# EAGLE schematic robo_sugador (EAGLE 9.1.1)
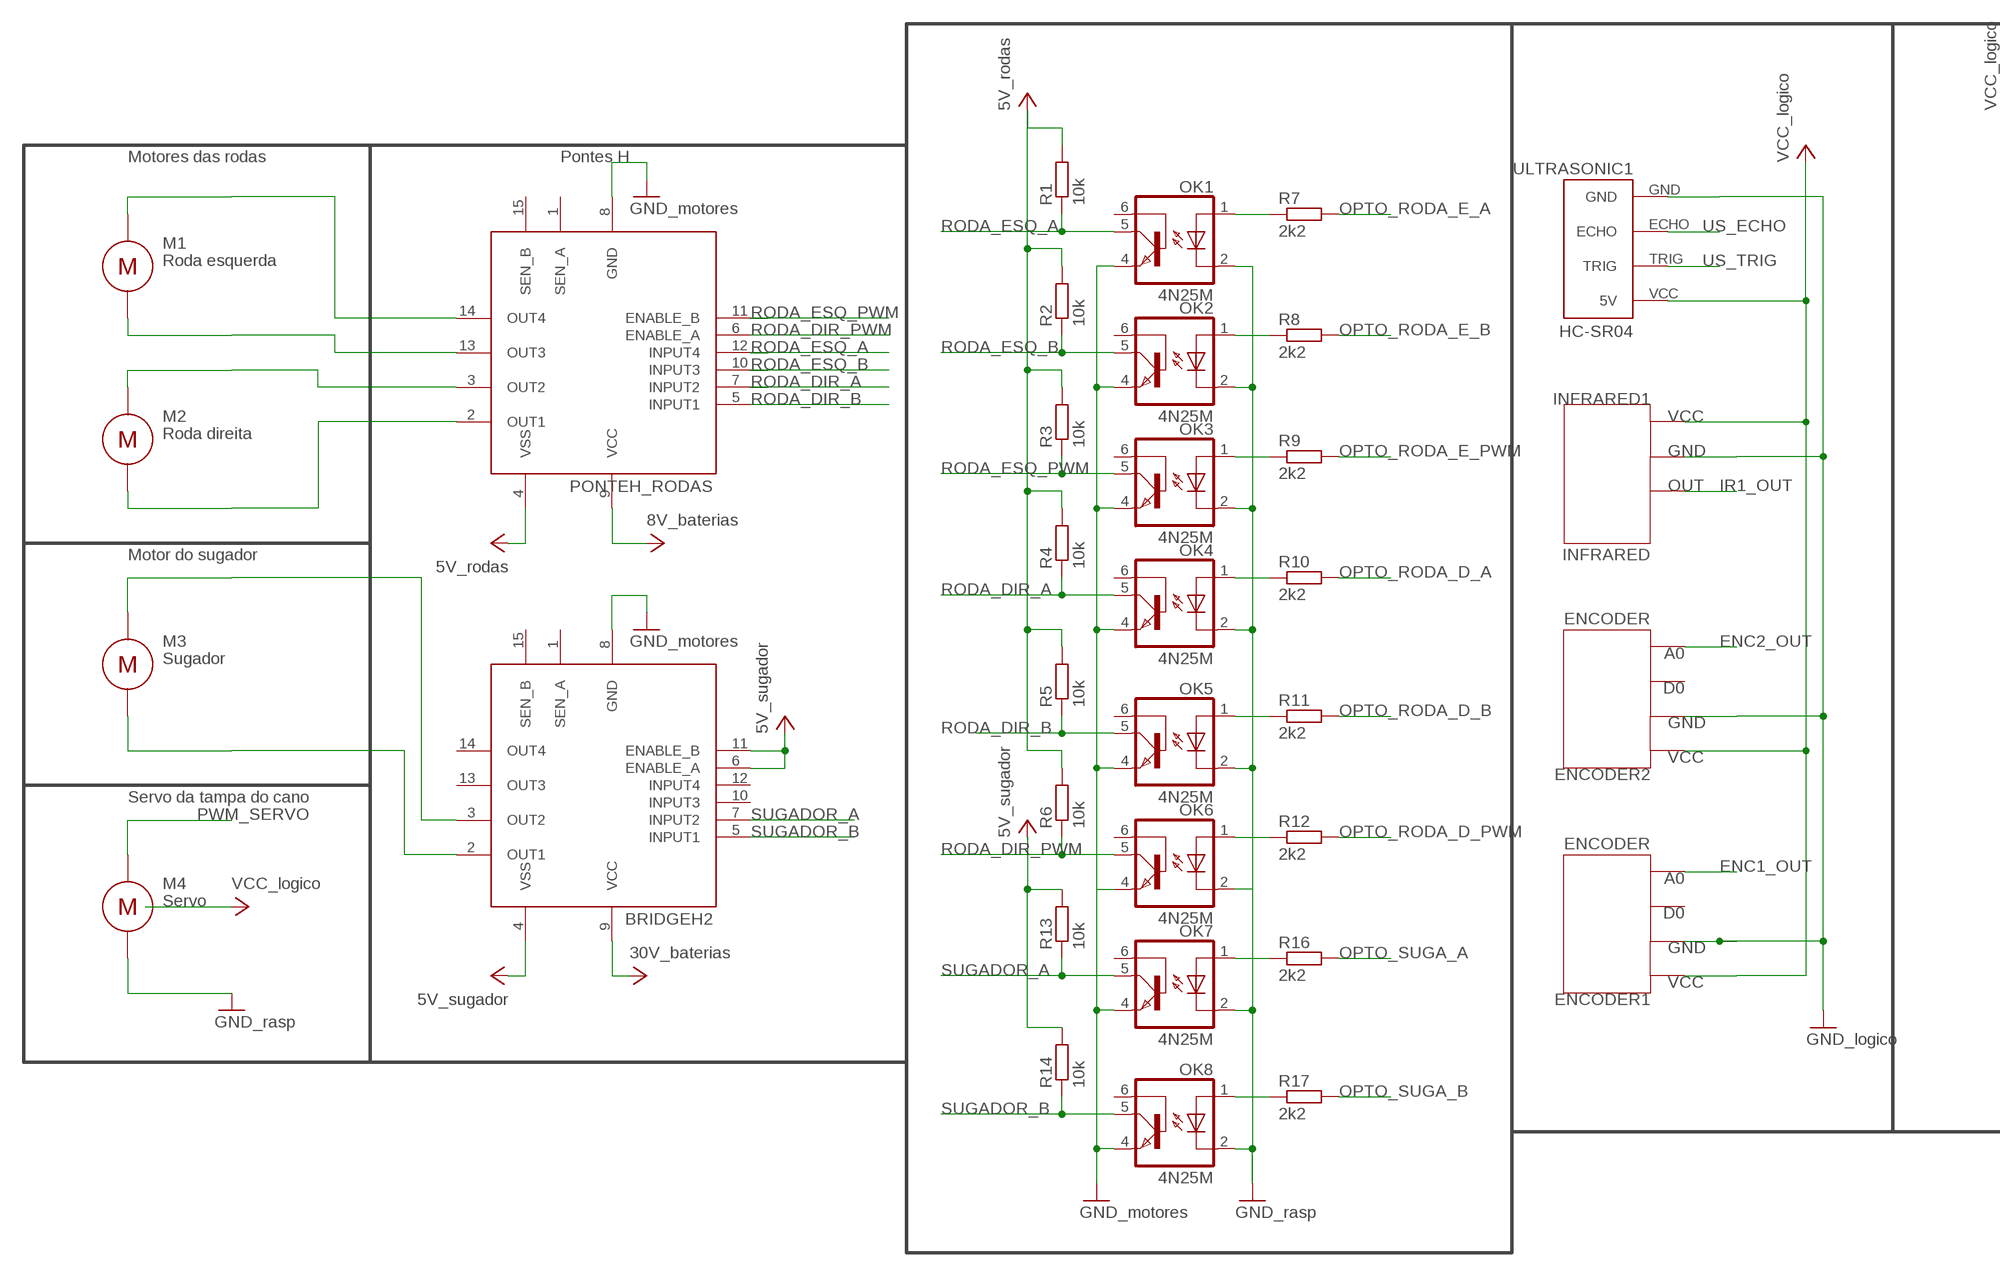
[diagram p0: schematic, sheet 1, part 1 of 2]
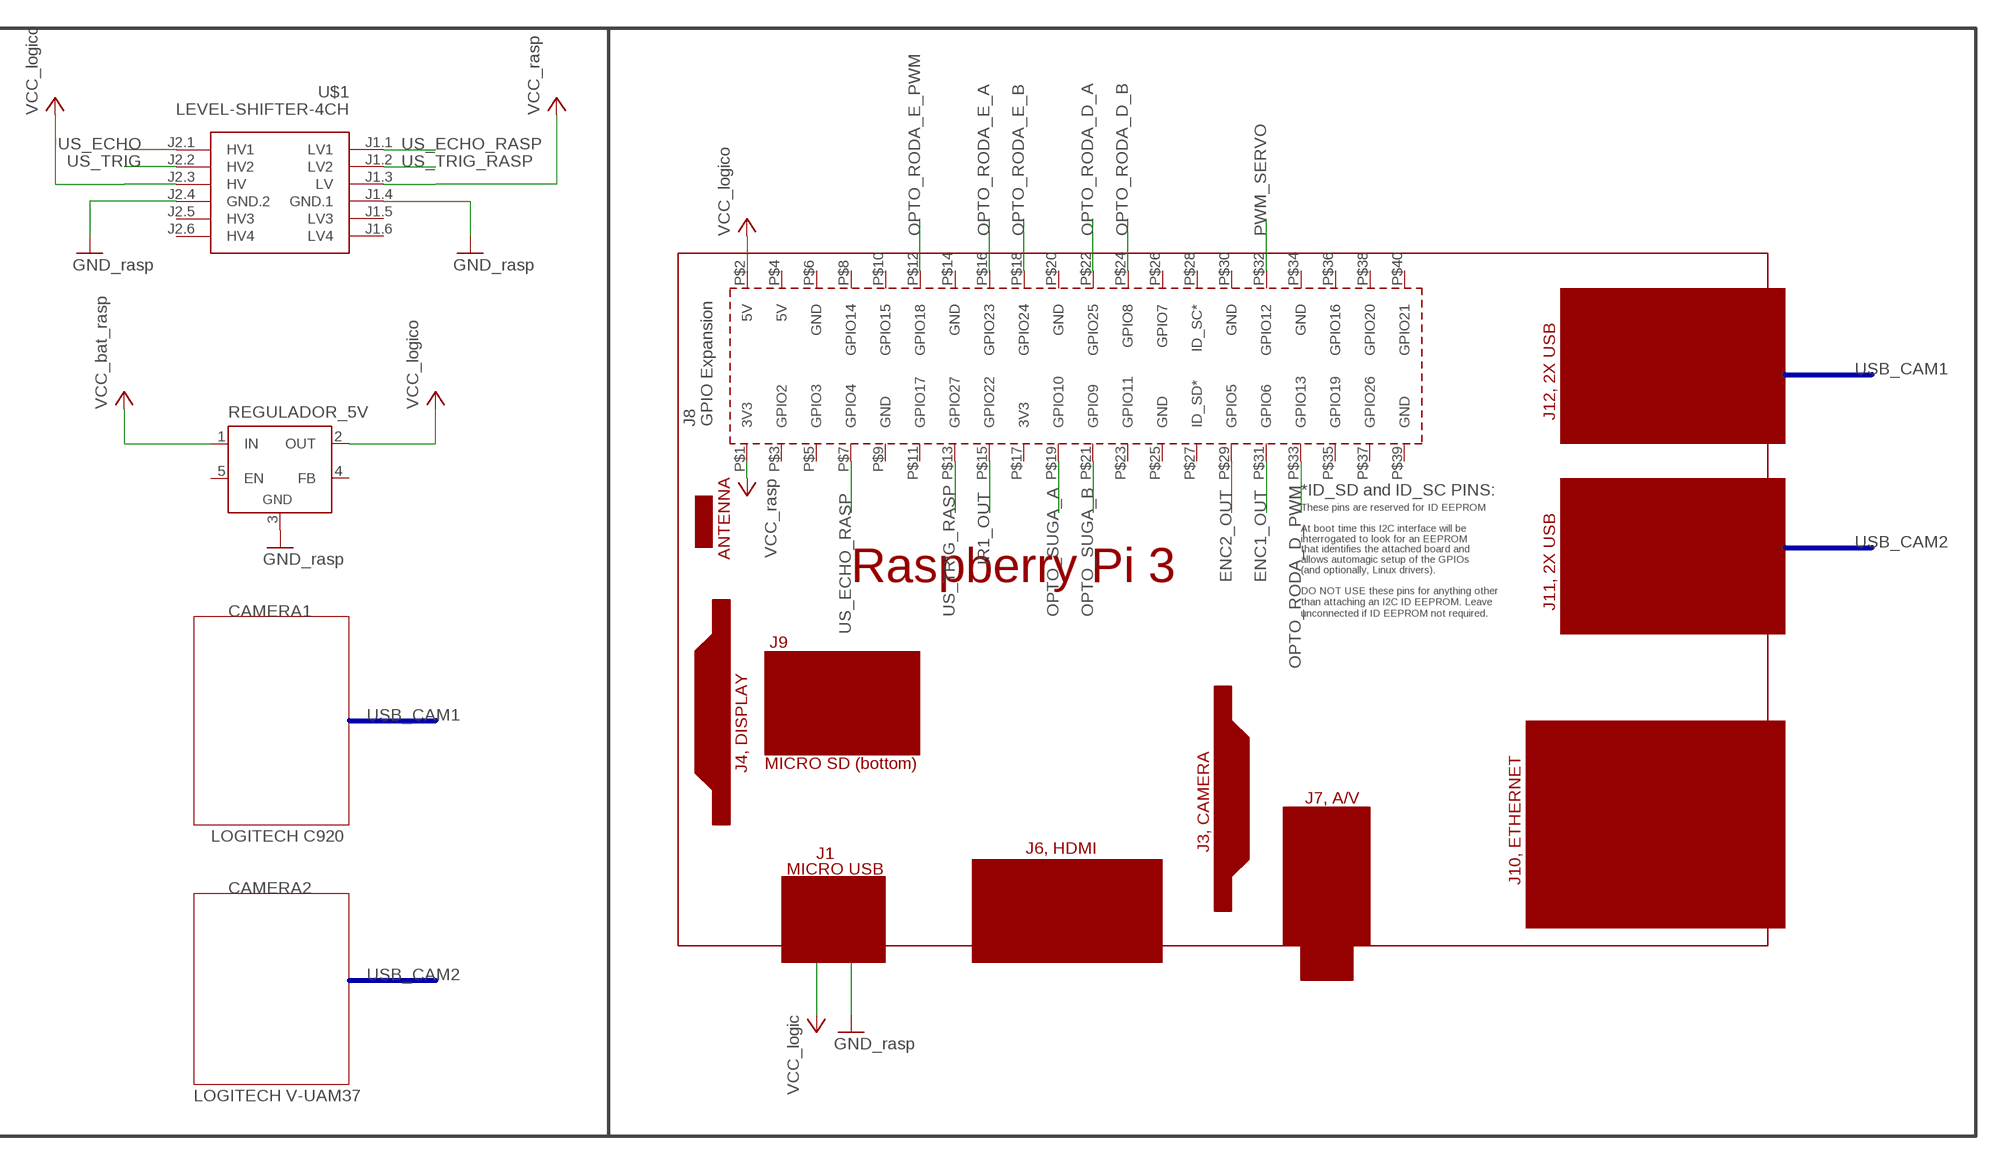
[diagram p1: schematic, sheet 1, part 2 of 2]

## Parts
BRIDGEH2  L298  [MW-15]
M1  Roda esquerda  308-100  [308-100]
M2  Roda direita  308-100  [308-100]
M3  Sugador  308-100  [308-100]
M4  Servo  308-100  [308-100]
OK1  4N25M  [DIL06]
OK2  4N25M  [DIL06]
OK3  4N25M  [DIL06]
OK4  4N25M  [DIL06]
OK5  4N25M  [DIL06]
OK6  4N25M  [DIL06]
OK7  4N25M  [DIL06]
OK8  4N25M  [DIL06]
PCB1  RPI3RPI3  [RPI3]
PONTEH_RODAS  L298  [MW-15]
R1  10k  R-EU_0207/10  [0207/10]
R2  10k  R-EU_0207/10  [0207/10]
R3  10k  R-EU_0207/10  [0207/10]
R4  10k  R-EU_0207/10  [0207/10]
R5  10k  R-EU_0207/10  [0207/10]
R6  10k  R-EU_0207/10  [0207/10]
R7  2k2  R-EU_0207/10  [0207/10]
R8  2k2  R-EU_0207/10  [0207/10]
R9  2k2  R-EU_0207/10  [0207/10]
R10  2k2  R-EU_0207/10  [0207/10]
R11  2k2  R-EU_0207/10  [0207/10]
R12  2k2  R-EU_0207/10  [0207/10]
R13  10k  R-EU_0207/10  [0207/10]
R14  10k  R-EU_0207/10  [0207/10]
R16  2k2  R-EU_0207/10  [0207/10]
R17  2k2  R-EU_0207/10  [0207/10]
REGULADOR_5V  LM2596TH  [TO220-52]
U$1  LEVEL-SHIFTER-4CH  [LEVEL-SHIFTER-4CH]
ULTRASONIC1  HC-SR04  [HC-SR04_FOOTPRINT]

## Nets
ENC1_OUT: PCB1.P$31(GPIO6)
ENC2_OUT: PCB1.P$29(GPIO5)
GND: BRIDGEH2.8(GND) M4.NEG OK7.2(C) OK7.4(EMI) OK8.2(C) OK8.4(EMI) PONTEH_RODAS.8(GND) REGULADOR_5V.3(GND) U$1.J1.4(GND.1) U$1.J2.4(GND.2) ULTRASONIC1.GND ; supply symbol labelled GND_motores, GND_logico, GND_rasp
IR1_OUT: PCB1.P$15(GPIO22)
N$1: BRIDGEH2.3(OUT2) M3.POS
N$2: OK7.1(A) R16.1
N$3: BRIDGEH2.2(OUT1) M3.NEG
N$4: OK8.1(A) R17.1
N$8: OK1.4(EMI) OK2.4(EMI) OK3.4(EMI) OK4.4(EMI) OK5.4(EMI) OK6.4(EMI)
N$10: M1.POS PONTEH_RODAS.14(OUT4)
N$11: M1.NEG PONTEH_RODAS.13(OUT3)
N$12: M2.POS PONTEH_RODAS.3(OUT2)
N$13: M2.NEG PONTEH_RODAS.2(OUT1)
N$14: OK1.2(C) OK2.2(C) OK3.2(C) OK4.2(C) OK5.2(C) OK6.2(C)
N$30: OK1.1(A) R7.1
N$31: OK2.1(A) R8.1
N$32: OK3.1(A) R9.1
N$33: OK4.1(A) R10.1
N$34: OK5.1(A) R11.1
N$35: OK6.1(A) R12.1
OPTO_RODA_D_A: PCB1.P$22(GPIO25) R10.2
OPTO_RODA_D_B: PCB1.P$24(GPIO8) R11.2
OPTO_RODA_D_PWM: PCB1.P$33(GPIO13) R12.2
OPTO_RODA_E_A: PCB1.P$16(GPIO23) R7.2
OPTO_RODA_E_B: PCB1.P$18(GPIO24) R8.2
OPTO_RODA_E_PWM: PCB1.P$12(GPIO18) R9.2
OPTO_SUGA_A: PCB1.P$19(GPIO10) R16.2
OPTO_SUGA_B: PCB1.P$21(GPIO9) R17.2
PWM_SERVO: M4.POS PCB1.P$32(GPIO12)
RODA_DIR_A: OK4.5(COL) PONTEH_RODAS.7(INPUT2) R4.1
RODA_DIR_B: OK5.5(COL) PONTEH_RODAS.5(INPUT1) R5.1
RODA_DIR_PWM: OK6.5(COL) PONTEH_RODAS.6(ENABLE_A) R6.1
RODA_ESQ_A: OK1.5(COL) PONTEH_RODAS.12(INPUT4) R1.1
RODA_ESQ_B: OK2.5(COL) PONTEH_RODAS.10(INPUT3) R2.1
RODA_ESQ_PWM: OK3.5(COL) PONTEH_RODAS.11(ENABLE_B) R3.1
SUGADOR_A: BRIDGEH2.7(INPUT2) OK7.5(COL) R13.1
SUGADOR_B: BRIDGEH2.5(INPUT1) OK8.5(COL) R14.1
US_ECHO: U$1.J2.1(HV1) ULTRASONIC1.ECHO
US_ECHO_RASP: PCB1.P$7(GPIO4) U$1.J1.1(LV1)
US_TRIG: U$1.J2.2(HV2) ULTRASONIC1.TRIG
US_TRIG_RASP: PCB1.P$13(GPIO27) U$1.J1.2(LV2)
VCC: BRIDGEH2.4(VSS) BRIDGEH2.6(ENABLE_A) BRIDGEH2.9(VCC) BRIDGEH2.11(ENABLE_B) PCB1.P$1(3V3) PCB1.P$2(5V) PONTEH_RODAS.4(VSS) PONTEH_RODAS.9(VCC) R1.2 R2.2 R3.2 R4.2 R5.2 R6.2 R13.2 R14.2 REGULADOR_5V.1(IN) REGULADOR_5V.2(OUT) U$1.J1.3(LV) U$1.J2.3(HV) ULTRASONIC1.VCC(5V) ; supply symbol labelled 5V_rodas, 5V_sugador, VCC_logico, 8V_baterias, 30V_baterias, VCC_rasp, VCC_bat_rasp, VCC_logic
Unconnected: BRIDGEH2.1(SEN_A) BRIDGEH2.10(INPUT3) BRIDGEH2.12(INPUT4) BRIDGEH2.13(OUT3) BRIDGEH2.14(OUT4) BRIDGEH2.15(SEN_B) OK1.6(BAS) OK2.6(BAS) OK3.6(BAS) OK4.6(BAS) OK5.6(BAS) OK6.6(BAS) OK7.6(BAS) OK8.6(BAS) PCB1.P$3(GPIO2) PCB1.P$4(5V) PCB1.P$5(GPIO3) PCB1.P$6(GND) PCB1.P$8(GPIO14) PCB1.P$9(GND) PCB1.P$10(GPIO15) PCB1.P$11(GPIO17) PCB1.P$14(GND) PCB1.P$17(3V3) PCB1.P$20(GND) PCB1.P$23(GPIO11) PCB1.P$25(GND) PCB1.P$26(GPIO7) PCB1.P$27(ID_SD*) PCB1.P$28(ID_SC*) PCB1.P$30(GND) PCB1.P$34(GND) PCB1.P$35(GPIO19) PCB1.P$36(GPIO16) PCB1.P$37(GPIO26) PCB1.P$38(GPIO20) PCB1.P$39(GND) PCB1.P$40(GPIO21) PONTEH_RODAS.1(SEN_A) PONTEH_RODAS.15(SEN_B) REGULADOR_5V.4(FB) REGULADOR_5V.5(EN) U$1.J1.5(LV3) U$1.J1.6(LV4) U$1.J2.5(HV3) U$1.J2.6(HV4)

## Buses
USB_CAM1
USB_CAM2

## Notes on the sheet
- Motores das rodas | Pontes H
- INFRARED1
- VCC
- GND
- OUT
- Motor do sugador | INFRARED
- ENCODER | CAMERA1
- A0
- D0
- GND
- VCC
- ENCODER2
- Servo da tampa do cano
- ENCODER | LOGITECH C920
- A0
- CAMERA2
- D0
- GND
- VCC
- ENCODER1
- LOGITECH V-UAM37

## Library data of the parts
BRIDGEH2 PONTEH_RODAS = h-bridge:L298
M1-M4 = motor:308-100: Pico Vibe 8mm Vibration Motor - 3mm Type; PRECISION_MICRODRIVES: 308-100
OK1-OK8 = optocoupler:4N*?M: General Purpose 6-Pin Phototransistor Optocouplers Source: http://www.fairchildsemi.com/ds/4N/4N35-M.pdf; MPN: 4N25-M; OC_FARNELL: 1021349; OC_NEWARK: 98K9084
PCB1 = e14_Rpi3_RevA+mirror-pcb:RPI3: Device for Raspberry Pi 3 board created by Dave Young for www.element14.com More information and support community is available at https://www.element14.com/community/community/raspberry-pi Device for Raspberry Pi 3 board updated by Gerald Schwarz for www.element14.com On RPI3 addet the layer milling and created a mirrored shield.
R1-R14 R16 R17 = resistor:R-EU_: RESISTOR, European symbol
REGULADOR_5V = linear:LM2596T: STEP-DOWN VOLTAGE REGULATOR
U$1 = diy-modules:LEVEL-SHIFTER-4CH: 4-Channel Bi-Directional Logic Level Converter based on BSS128 transistors Click here to find device on ebay.com <http://www.ebay.com/sch/i2c+logic+converter+module>
ULTRASONIC1 = Ultrasonic Sensor HC-SR04:HC-SR04: Ultrasonic Sensor HC-SR04